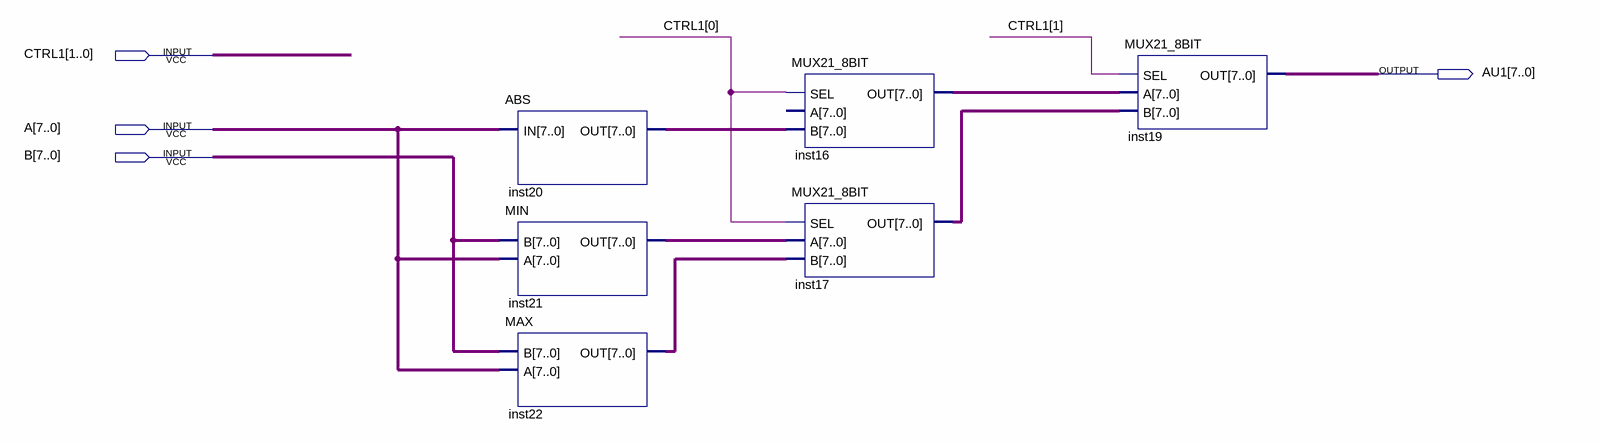
[diagram p0: schematic sheet]
// Quartus schematic AU1.bdf as structural Verilog: 6 symbols, 4 pins
module AU1 (
  input  [1:0] CTRL1,
  input  [7:0] A,
  input  [7:0] B,
  output [7:0] AU1
);

  wire [7:0] inst16_out, inst17_out, inst20_out, inst21_out, inst22_out;

  ABS inst20 (.IN(A), .OUT(inst20_out));
  MIN inst21 (.B(B), .A(A), .OUT(inst21_out));
  MAX inst22 (.B(B), .A(A), .OUT(inst22_out));
  MUX21_8BIT inst16 (.SEL(CTRL1[0]), .B(inst20_out), .OUT(inst16_out));  // open: A
  MUX21_8BIT inst17 (.SEL(CTRL1[0]), .A(inst21_out), .B(inst22_out), .OUT(inst17_out));
  MUX21_8BIT inst19 (.SEL(CTRL1[1]), .A(inst16_out), .B(inst17_out), .OUT(AU1));
endmodule
